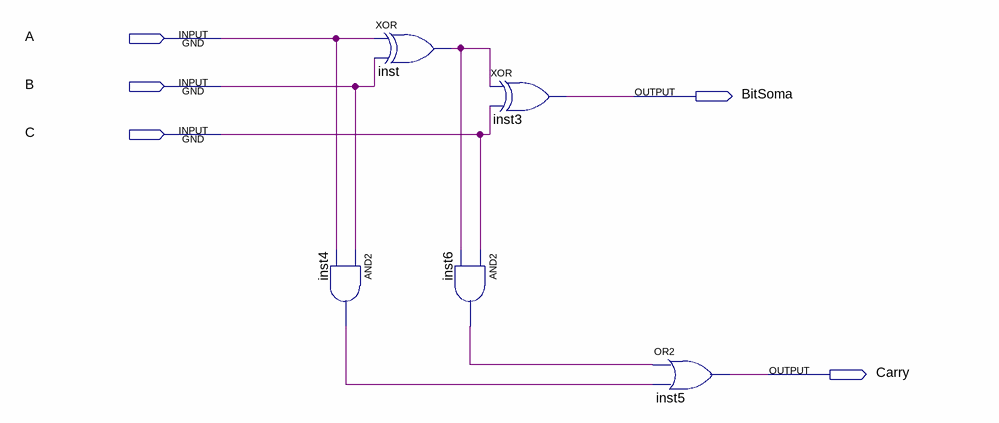
[diagram p0: schematic sheet]
// Quartus schematic somadorBit.bdf as structural Verilog: 5 symbols, 5 pins
module somadorBit (
  input  A,
  input  B,
  input  C,
  output BitSoma,
  output Carry
);

  wire inst4_out, inst6_out, inst_out;

  and inst4 (inst4_out, B, A);
  xor inst (inst_out, A, B);
  xor inst3 (BitSoma, inst_out, C);
  and inst6 (inst6_out, C, inst_out);
  or inst5 (Carry, inst6_out, inst4_out);
endmodule
